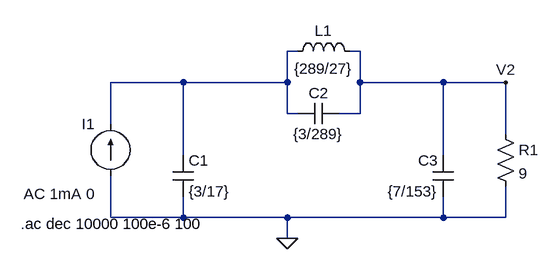
[diagram p0: schematic TS13_2.asc]
TS13_2.asc, the LTspice schematic file:
Version 4
SHEET 1 880 680
WIRE 176 -32 160 -32
WIRE 272 -32 256 -32
WIRE 0 16 -112 16
WIRE 160 16 160 -32
WIRE 160 16 0 16
WIRE 272 16 272 -32
WIRE 400 16 272 16
WIRE 496 16 400 16
WIRE 160 64 160 16
WIRE 176 64 160 64
WIRE 272 64 272 16
WIRE 272 64 240 64
WIRE -112 80 -112 16
WIRE 496 96 496 16
WIRE 0 128 0 16
WIRE 400 128 400 16
WIRE -112 224 -112 160
WIRE 0 224 0 192
WIRE 0 224 -112 224
WIRE 160 224 0 224
WIRE 400 224 400 192
WIRE 400 224 160 224
WIRE 496 224 496 176
WIRE 496 224 400 224
WIRE 160 256 160 224
FLAG 160 256 0
FLAG 496 16 V2
SYMBOL cap -16 128 R0
SYMATTR InstName C1
SYMATTR Value {3/17}
SYMBOL cap 240 48 R90
WINDOW 0 0 32 VBottom 2
WINDOW 3 32 32 VTop 2
SYMATTR InstName C2
SYMATTR Value {3/289}
SYMBOL cap 416 192 R180
WINDOW 0 24 56 Left 2
WINDOW 3 24 8 Left 2
SYMATTR InstName C3
SYMATTR Value {7/153}
SYMBOL ind 160 -16 R270
WINDOW 0 32 56 VTop 2
WINDOW 3 5 56 VBottom 2
SYMATTR InstName L1
SYMATTR Value {289/27}
SYMBOL current -112 160 R180
WINDOW 0 24 80 Left 2
WINDOW 3 24 0 Left 2
WINDOW 123 24 -28 Left 2
WINDOW 39 0 0 Left 0
SYMATTR InstName I1
SYMATTR Value ""
SYMATTR Value2 AC 1mA 0
SYMBOL res 480 80 R0
SYMATTR InstName R1
SYMATTR Value 9
TEXT -250 234 Left 2 !.ac dec 10000 100e-6 100

The netlist it stands for:
* TS13_2.asc
C1 N001 0 {3/17}
C2 V2 N001 {3/289}
C3 0 V2 {7/153}
L1 N001 V2 {289/27}
I1 0 N001 AC 1mA 0
R1 V2 0 9
.ac dec 10000 100e-6 100
.backanno
.end